# EasyEDA schematic duet06_exp_2020-12-20_20-36-14.json
TITLE: add close loop motor; REV: 1.0; Date: 2020-12-20; Sheet: 1/1; Drawn By: fedoseev2004
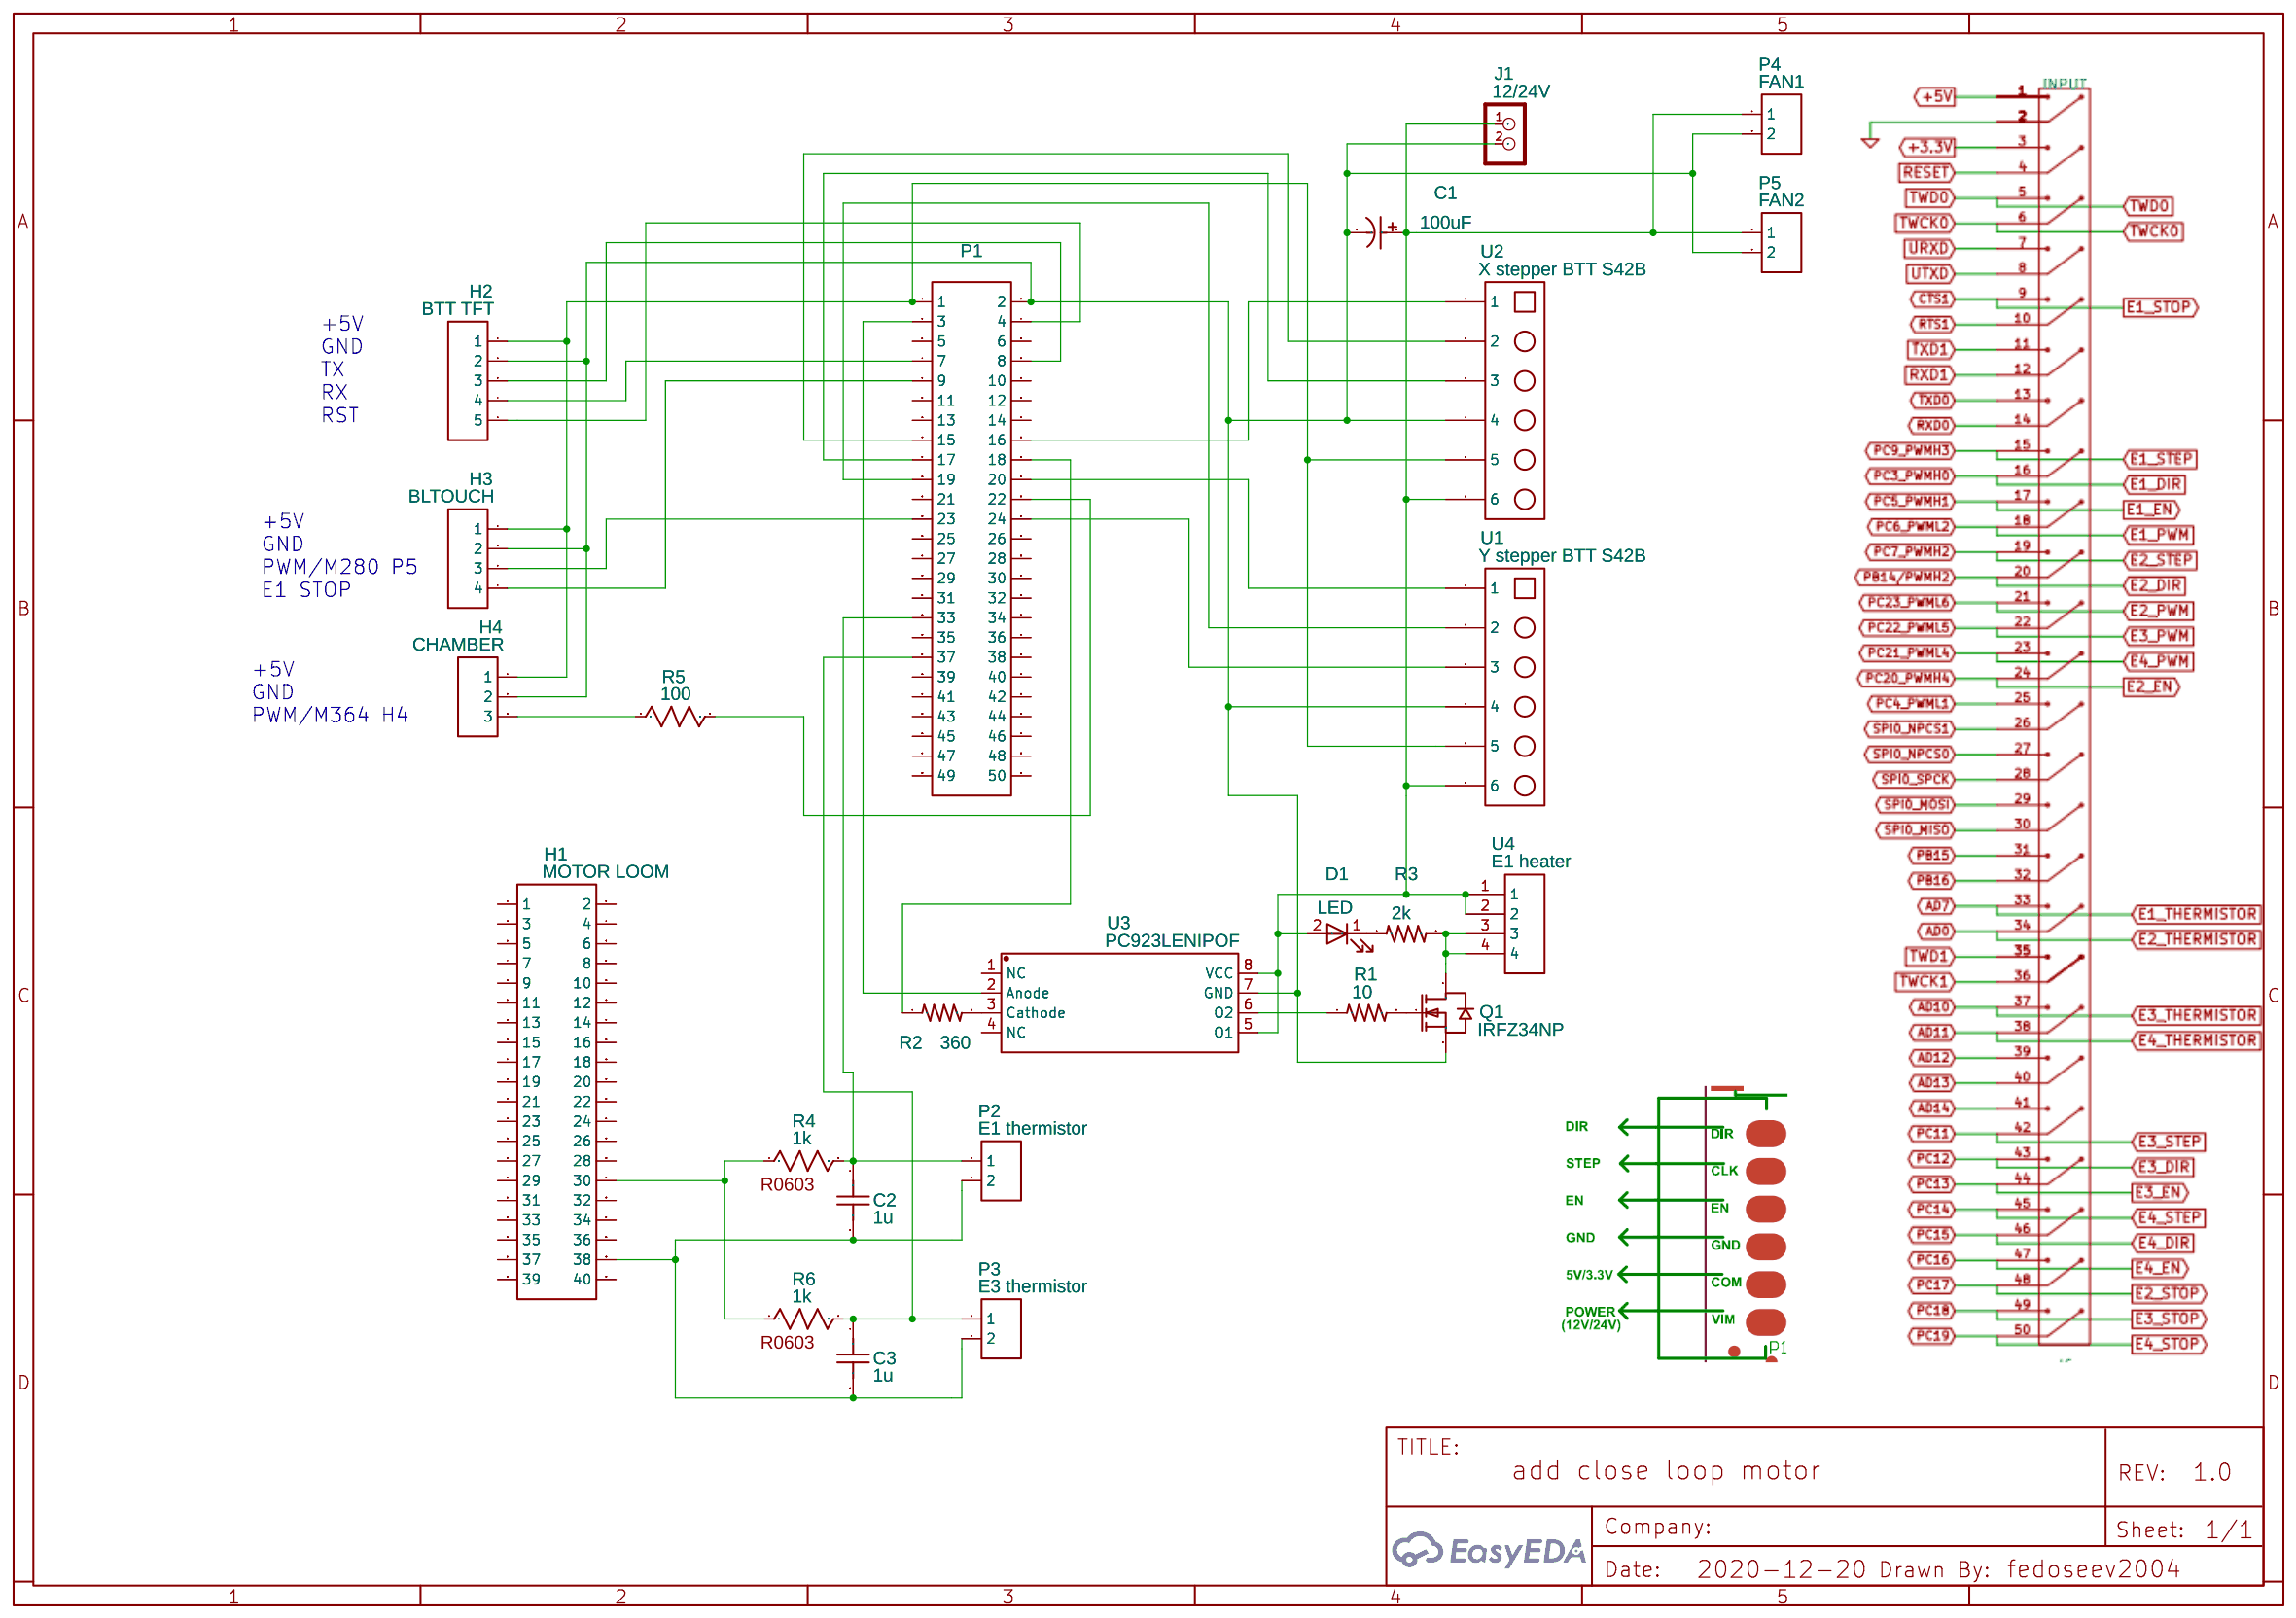
[diagram p0: schematic sheet]

## Parts
C1  100uF  [CAP-TH_BD8.0-P3.50-D1.0-FD]
C2  1u  [C0603]
C3  1u  [C0603]
D1  LED
H1  MOTOR LOOM  [HDR-F-2.54_2X20]
H2  BTT TFT  [HDR-F-2.54_1X5]
H3  BLTOUCH  [HDR-F-2.54_1X4]
H4  CHAMBER  [HDR-F-2.54_1X3]
J1  12/24V  [TERMINAL_BLOCK_2P_5]
P1  Header-Female-2.54_2x25  [HDR-TH_40PIN-V-ROW2-COL20-FEMALE-PITCH2.54]
P2  E1 thermistor  [MOLEX_KK-6410-02_02X2.54MM_STRAIGHT]
P3  E3 thermistor  [MOLEX_KK-6410-02_02X2.54MM_STRAIGHT]
P4  FAN1  [MOLEX_KK-6410-02_02X2.54MM_STRAIGHT]
P5  FAN2  [MOLEX_KK-6410-02_02X2.54MM_STRAIGHT]
Q1  IRFZ34NP  [TO-220AB-3_L10.3-W5.0-P2.54-L]
R1  10  [0805]
R2  360  [0805]
R3  2k  [0805]
R4  1k  [R0603]
R5  100  [R0603]
R6  1k  [R0603]
U1  Y stepper BTT S42B  [JST_XH_B06B-XH-A_06X2.50MM_STRAIGHT]
U2  X stepper BTT S42B  [JST_XH_B06B-XH-A_06X2.50MM_STRAIGHT]
U3  PC923LENIPOF  [SOP-8_L9.8-W6.6-P2.54-LS10.3-BL]
U4  E1 heater  [MOLEX-1X4_STRAIGHT]

## Library data of the parts
C1 = 100uF 63V 8*14: Supplier: LCSC; Manufacturer: ValuePro; Supplier Part: C45674; Package Display: No
C2 C3 = C_0603_US: Contributor: LCEDA_Lib; Package Display: No
D1 = LED: Contributor: fedoseev2004; Package Display: Yes
H1 = HDR-F-2.54_2x20: Supplier Part: C50982; Supplier: LCSC; Contributor: LCEDA_Lib; Package Display: No
H2 = HDR-F-2.54_1x5: Supplier Part: C50950; Supplier: LCSC; Contributor: LCEDA_Lib; Package Display: No
H3 = HDR-F-2.54_1x4: Supplier Part: C225501; Supplier: LCSC; Contributor: LCEDA_Lib; Package Display: No
H4 = HDR-F-2.54_1x3: Supplier Part: C146690; Supplier: LCSC; Contributor: LCEDA_Lib; Package Display: No
J1 = CON_TERMINAL_BLOCK_02-5MM: 2 poles wire to board terminal block; Contributor: DangerousPrototype; Package Display: No; Supplier: LCSC
P1 = Header-Female-2.54_2x25: Supplier: LCSC; Manufacturer: BOOMELE; Manufacturer Part: 2.54mm 2*20PFemale header; image: //image.lceda.cn/szlcsc/C50982.jpg; Supplier Part: C50982; Package Display: No
P2-P5 = CONN-TH_2P-P5.00: Supplier: LCSC; Contributor: LCEDA_Lib; Package Display: No
Q1 = IRFZ34NP: Supplier: LCSC; Supplier Part: C878828; Manufacturer: VBsemi Elec; Contributor: LCSC; Package Display: No
R1-R3 = RESISTOR0805: Contributor: fedoseev2004; Package Display: No
R4 R6 = R_0603_US: Contributor: LCEDA_Lib; Package Display: Yes
R5 = R_0603_US: Contributor: LCEDA_Lib; Package Display: No
U1 = JST_XH CONNECTOR 6P: Manufacturer Part: JST_XH CONNECTOR; link: https://nl.aliexpress.com/item/50-sets-Kit-in-doos-2-p-3-p-4-pin-2-54mm-Pitch-Terminal-Behuizing/32681086028.html?spm=a2g0s.9042311.0.0.I0g15Z; Contributor: fisheye; Supplier: LCSC; Package Display: No
U2 = JST_XH CONNECTOR 6P: Manufacturer Part: JST_XH CONNECTOR; link: https://nl.aliexpress.com/item/50-sets-Kit-in-doos-2-p-3-p-4-pin-2-54mm-Pitch-Terminal-Behuizing/32681086028.html?spm=a2g0s.9042311.0.0.I0g15Z; Contributor: fisheye; Package Display: No
U3 = PC923LENIPOF: Supplier: LCSC; Manufacturer: SHARP; Supplier Part: C47423; SMT Type: Extend; JLCPCB SMD: Yes; Package Display: No
U4 = Molex 4 Pins_Stiftleiste_Straight: Manufacturer Part: Molex_4x1; Contributor: Nostalgie; Package Display: No

## Nets
Net-(C1-1): C1.1 D1.2(A) J1.1 P4.1 P5.1 U1.6 U2.6 U3.5(O1) U3.8(VCC) U4.1 U4.2
Net-(C1-2): C1.2 H2.2 H3.2 H4.2 J1.2 P1.2 P4.2 P5.2 Q1.3(S) U1.4 U2.4 U3.7(GND)
Net-(C2-1): C2.1 P1.33(43) P2.1 R4.2
Net-(C2-2): C2.2 C3.2 H1.38 P2.2 P3.2
Net-(C3-1): C3.1 P1.37(47) P3.1 R6.2
Net-(D1-1): D1.1(K) R3.1
Net-(H1-30): H1.30 R4.1 R6.1
Net-(H2-1): H2.1 H3.1 H4.1 P1.1 U1.5 U2.5
Net-(H2-3): H2.3 P1.8
Net-(H2-4): H2.4 P1.7
Net-(H2-5): H2.5 P1.4
Net-(H3-3): H3.3 P1.23
Net-(H3-4): H3.4 P1.9
Net-(H4-3): H4.3 R5.1
Net-(P1-3): P1.3 U3.2(Anode)
Net-(P1-15): P1.15 U2.2
Net-(P1-16): P1.16 U2.1
Net-(P1-17): P1.17 U2.3
Net-(P1-18): P1.18 R2.1
Net-(P1-19): P1.19 U1.2
Net-(P1-20): P1.20 U1.1
Net-(P1-22): P1.22 R5.2
Net-(P1-24): P1.24 U1.3
Net-(Q1-1): Q1.1(G) R1.2
Net-(Q1-2): Q1.2(D) R3.2 U4.3 U4.4
Net-(R1-1): R1.1 U3.6(O2)
Net-(R2-2): R2.2 U3.3(Cathode)

Not connected (* = marked no-connect by the designer): H1 1 2 3 4 5 6 7 8 9 10 11 12 13 14 15 16 17 18 19 20 21 22 23 24 25 26 27 28 29 31 32 33 34 35 36 37 39 40; P1 5 6 10 11 12 13 14 21 25 26 27 28 29 30 31(41) 32(42) 34(44) 35(45) 36(46) 38(48) 39(49) 40(50); U3 1(NC) 4(NC)

## Notes on the sheet
- +5V
  GND
  TX
  RX
  RST
- +5V
  GND
  PWM/M280 P5
  E1 STOP
- +5V
  GND
  PWM/M364 H4
